# Altium project LowPowerWearable.PrjPcb
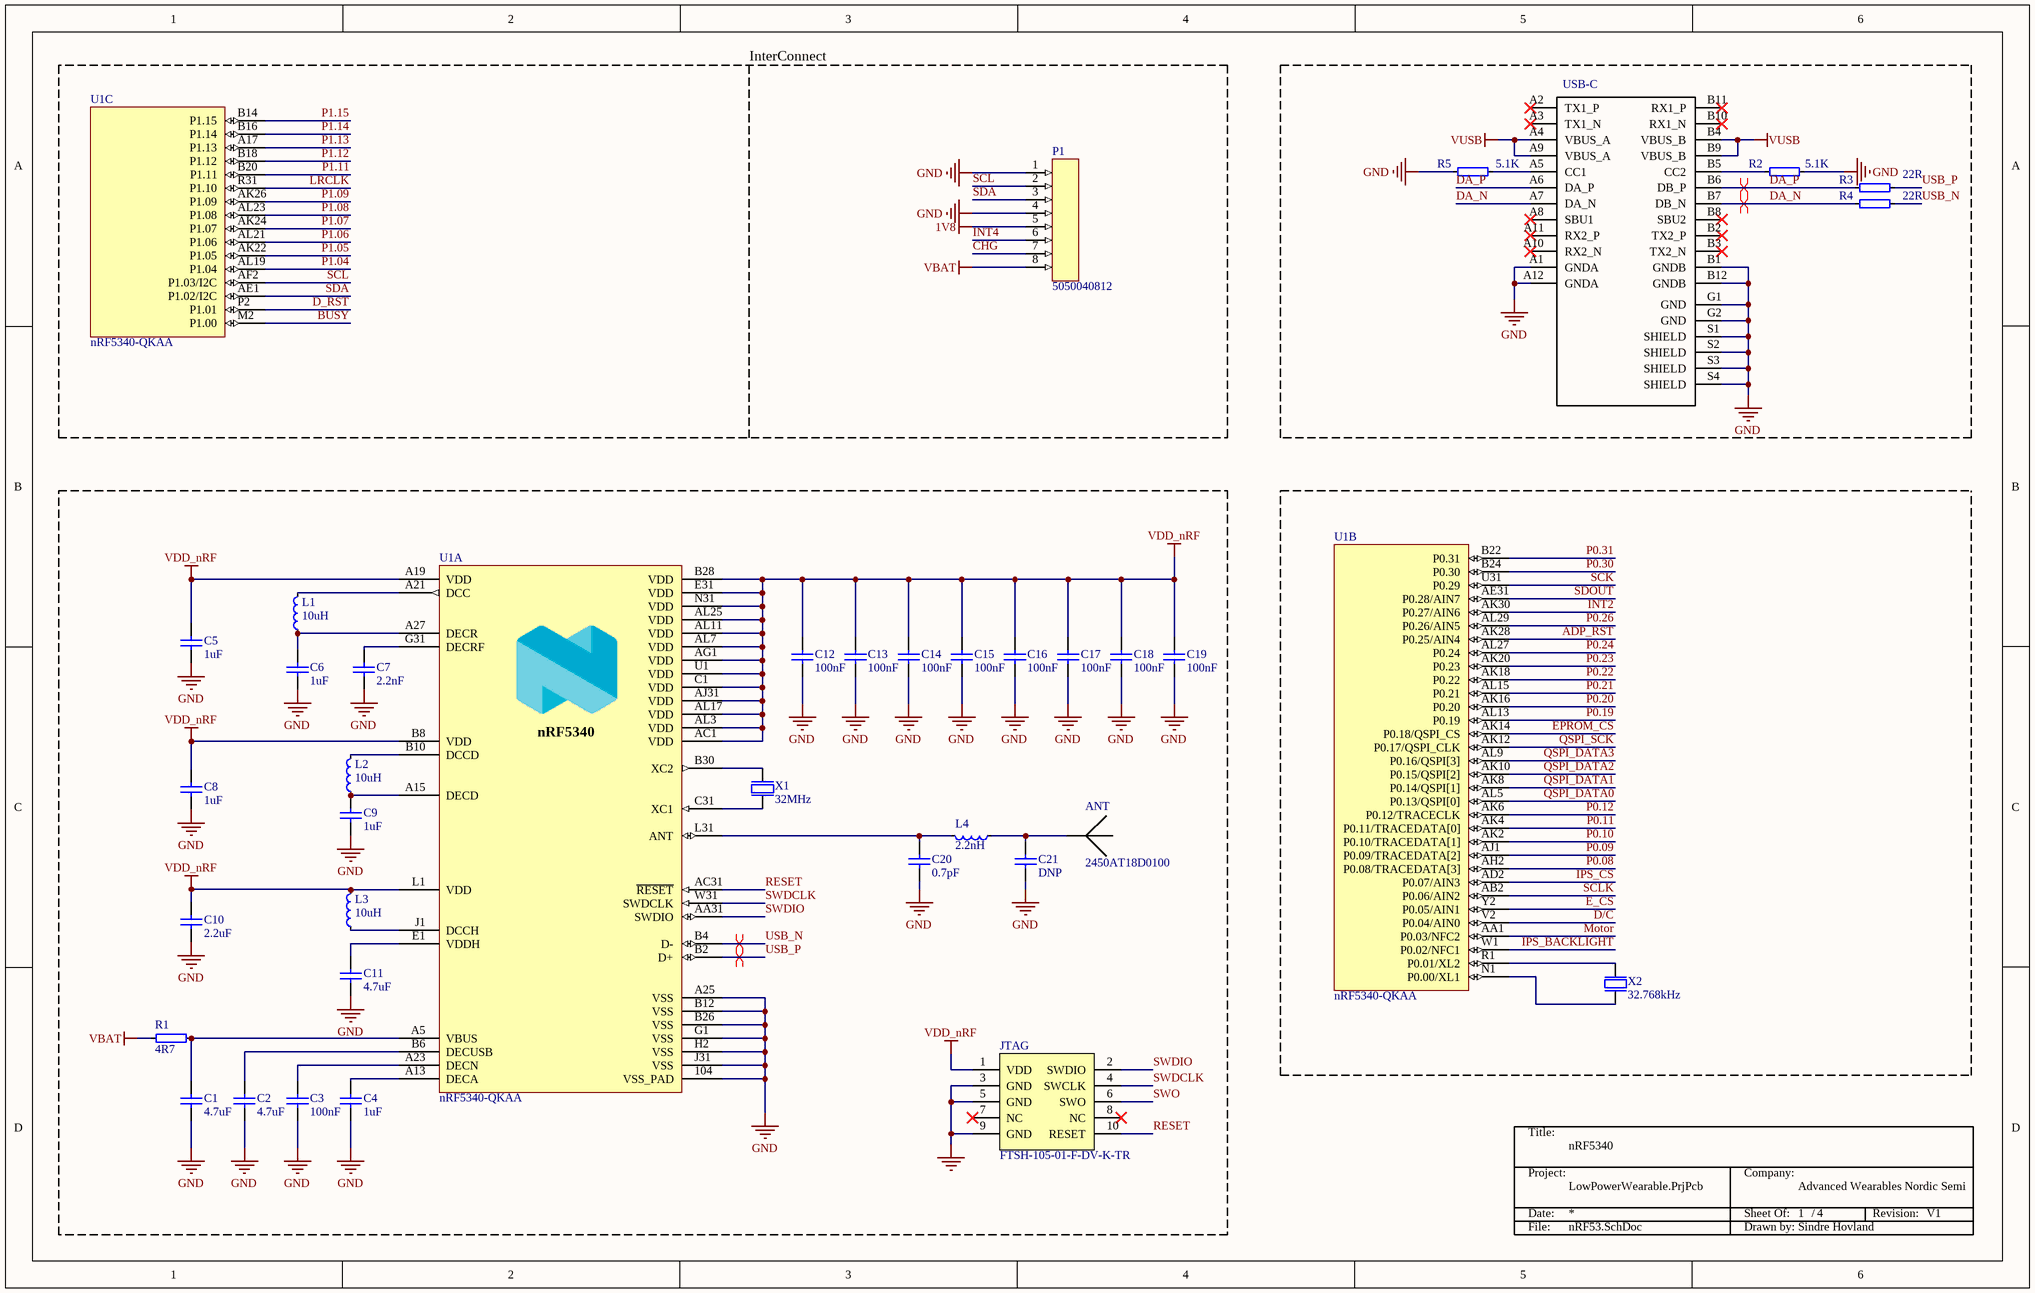
[diagram p0: nRF53.SchDoc]
4 sheets, 104 parts. Net scope: global (net labels, ports and power ports of the same name join across sheets).
Board file: Layout.PcbDoc
Sheets:
  nRF53.SchDoc
  Sensors.SchDoc
  Power.SchDoc
  Display.SchDoc

## Sheet nRF53.SchDoc: nRF5340
size B; DrawnBy: Sindre Hovland; Organization: Advanced Wearables Nordic Semi; Revision: V1; SheetNumber: 1; SheetTotal: 4

### Parts
(Parts that share a designator on the sheet are numbered #1, #2 ... from top to bottom, then left to right.)
*#1  TitleBlock  (value not drawn)  (graphical)
ANT  2450AT18D0100  [2450AT18D0100_STD-L - Thin space]
C1  4.7uF  [C0402]
C2  4.7uF  [C0402]
C3  100nF  [C0402]
C4  1uF  [C0402]
C5  1uF  [C0402]
C6  1uF  [C0402]
C7  2.2nF  [C0402]
C8  1uF  [C0402]
C9  1uF  [C0402]
C10  2.2uF  [C0402]
C11  4.7uF  [C0402]
C12  100nF  [C0402]
C13  100nF  [C0402]
C14  100nF  [C0402]
C15  100nF  [C0402]
C16  100nF  [C0402]
C17  100nF  [C0402]
C18  100nF  [C0402]
C19  100nF  [C0402]
C20  0.7pF  [C0402]
C21  DNP  [C0402]
JTAG  FTSH-105-01-F-DV-K-TR  [TC2050-IDC-NLFP]
L1  10uH  [IND0402]
L2  10uH  [IND0402]
L3  10uH  [IND0402]
L4  2.2nH  [IND0402]
P1  5050040812  [5050040812]
R1  4R7  [RES0402]
R2  5.1K  [RES0402]
R3  22R  [RES0402]
R4  22R  [RES0402]
R5  5.1K  [RES0402]
U1  nRF5340-QKAA  [nRF5340]  (parts A,B,C of 3)
USB-C  2305018-2  [TE_2305018-2_2305018-2(Primary)]  (value not drawn)
X1  32MHz  [XTAL_2016]
X2  32.768kHz  [XTAL_2012]

### Blocks framed on the sheet
InterConnect: P1 U1

### Nets
1V8: P1.5
GND: ANT.2(GND) C1.1 C2.1 C3.1 C4.1 C5.1 C6.1 C7.1 C8.1 C9.1 C10.1 C11.1 C12.1 C13.1 C14.1 C15.1 C16.1 C17.1 C18.1 C19.1 C20.1 C21.1 JTAG.3(GND) JTAG.5(GND) JTAG.9(GND) P1.1 P1.4 R2.2 R5.1 U1.104(VSS_PAD) U1.A25(VSS) U1.B12(VSS) U1.B26(VSS) U1.G1(VSS) U1.H2(VSS) U1.J31(VSS) USB-C.A1(GNDA) USB-C.A12(GNDA) USB-C.B1(GNDB) USB-C.B12(GNDB) USB-C.G1(GND) USB-C.G2(GND) USB-C.S1(SHIELD) USB-C.S2(SHIELD) USB-C.S3(SHIELD) USB-C.S4(SHIELD) X1.2(GND) X1.4(GND)
VBAT: P1.8 R1.2
VDD_nRF: C5.2 C8.2 C10.2 C12.2 C13.2 C14.2 C15.2 C16.2 C17.2 C18.2 C19.2 JTAG.1(VDD) L3.2 U1.A19(VDD) U1.AC1(VDD) U1.AG1(VDD) U1.AJ31(VDD) U1.AL3(VDD) U1.AL7(VDD) U1.AL11(VDD) U1.AL17(VDD) U1.AL25(VDD) U1.B8(VDD) U1.B28(VDD) U1.C1(VDD) U1.E31(VDD) U1.L1(VDD) U1.N31(VDD) U1.U1(VDD)
VUSB: USB-C.A4(VBUS_A) USB-C.A9(VBUS_A) USB-C.B4(VBUS_B) USB-C.B9(VBUS_B)
ADP_RST: U1.AK28(P0.25/AIN4)
BUSY: U1.M2(P1.00)
CHG: P1.7
D/C: U1.V2(P0.04/AIN0)
D_RST: U1.P2(P1.01)
DA_N: R4.1 USB-C.A7(DA_N) USB-C.B7(DB_N)
DA_P: R3.1 USB-C.A6(DA_P) USB-C.B6(DB_P)
E_CS: U1.Y2(P0.05/AIN1)
EPROM_CS: U1.AK14(P0.18/QSPI_CS)
INT2: U1.AK30(P0.27/AIN6)
INT4: P1.6
IPS_BACKLIGHT: U1.W1(P0.02/NFC1)
IPS_CS: U1.AD2(P0.07/AIN3)
LRCLK: U1.R31(P1.10)
Motor: U1.AA1(P0.03/NFC2)
P0.08: U1.AH2(P0.08/TRACEDATA[3])
P0.09: U1.AJ1(P0.09/TRACEDATA[2])
P0.10: U1.AK2(P0.10/TRACEDATA[1])
P0.11: U1.AK4(P0.11/TRACEDATA[0])
P0.12: U1.AK6(P0.12/TRACECLK)
P0.19: U1.AL13(P0.19)
P0.20: U1.AK16(P0.20)
P0.21: U1.AL15(P0.21)
P0.22: U1.AK18(P0.22)
P0.23: U1.AK20(P0.23)
P0.24: U1.AL27(P0.24)
P0.26: U1.AL29(P0.26/AIN5)
P0.30: U1.B24(P0.30)
P0.31: U1.B22(P0.31)
P1.04: U1.AL19(P1.04)
P1.05: U1.AK22(P1.05)
P1.06: U1.AL21(P1.06)
P1.07: U1.AK24(P1.07)
P1.08: U1.AL23(P1.08)
P1.09: U1.AK26(P1.09)
P1.11: U1.B20(P1.11)
P1.12: U1.B18(P1.12)
P1.13: U1.A17(P1.13)
P1.14: U1.B16(P1.14)
P1.15: U1.B14(P1.15)
QSPI_DATA0: U1.AL5(P0.13/QSPI[0])
QSPI_DATA1: U1.AK8(P0.14/QSPI[1])
QSPI_DATA2: U1.AK10(P0.15/QSPI[2])
QSPI_DATA3: U1.AL9(P0.16/QSPI[3])
QSPI_SCK: U1.AK12(P0.17/QSPI_CLK)
RESET: JTAG.10(RESET) U1.AC31(~{RESET})
SCK: U1.U31(P0.29)
SCL: P1.2 U1.AF2(P1.03/I2C)
SCLK: U1.AB2(P0.06/AIN2)
SDA: P1.3 U1.AE1(P1.02/I2C)
SDOUT: U1.AE31(P0.28/AIN7)
SWDCLK: JTAG.4(SWCLK) U1.W31(SWDCLK)
SWDIO: JTAG.2(SWDIO) U1.AA31(SWDIO)
SWO: JTAG.6(SWO)
USB_N: R4.2 U1.B4(D-)
USB_P: R3.2 U1.B2(D+)
NetANT_1: ANT.1 C21.2 L4.1
NetC1_2: C1.2 R1.1 U1.A5(VBUS)
NetC2_2: C2.2 U1.B6(DECUSB)
NetC3_2: C3.2 U1.A23(DECN)
NetC4_2: C4.2 U1.A13(DECA)
NetC6_2: C6.2 L1.1 U1.A27(DECR)
NetC7_2: C7.2 U1.G31(DECRF)
NetC9_2: C9.2 L2.1 U1.A15(DECD)
NetC11_2: C11.2 U1.E1(VDDH)
NetC20_2: C20.2 L4.2 U1.L31(ANT)
NetL1_2: L1.2 U1.A21(DCC)
NetL2_2: L2.2 U1.B10(DCCD)
NetL3_1: L3.1 U1.J1(DCCH)
NetR2_1: R2.1 USB-C.B5(CC2)
NetR5_2: R5.2 USB-C.A5(CC1)
NetU1_B30: U1.B30(XC2) X1.3(out)
NetU1_C31: U1.C31(XC1) X1.1(inp)
NetU1_N1: U1.N1(P0.00/XL1) X2.2(out)
NetU1_R1: U1.R1(P0.01/XL2) X2.1(inp)

Not connected (* = marked no-connect by the designer): JTAG 7(NC)* 8(NC)*; U1 AG31(N.C.) D2(N.C.) F2(N.C.) T2(N.C.); USB-C A2(TX1_P)* A3(TX1_N)* A8(SBU1)* A10(RX2_N)* A11(RX2_P)* B2(TX2_P)* B3(TX2_N)* B8(SBU2)* B10(RX1_N)* B11(RX1_P)*

### Layout directives
differential pair: DA_N, DA_P, USB_N, USB_P

### Notes on the sheet
- (in symbol nRF5340-QKAAAA, part A) nRF5340
- (in symbol TitleBlock) Title:; Project:; Company:; Date:; Sheet Of:; /; Revision:; File:; Drawn by:

### Library data of the parts
ANT = Antenna with GND: 2.45 GHz chip antenna; Part Number: Johanson 2450AT18D0100_STD-L; Manufacturer: Johanson Technology; Part number IPS: N.A.; Artikkelnr Noca: 53059035; Manufacturer Part Number: 2450AT18D0100; ComponentLink1URL: *; ComponentLink1Description: Datasheet; ComponentLink2URL: *; ComponentLink2Description: Supplier link; HelpURL: http://www.johansontechnology.com/datasheets/antennas/2450AT18D0100.pdf; Footprint Doc: 2450AT18D0100; LatestRevisionDate: 2016-06-02; Pin Count: 4; Publisher: Nordic Semiconductor; Published: 2016-01-12; Value: 2450AT18D0100; Note: *; Supplier 1: Digi-Key; Supplier Part Number 1: 2450AT18D0100E; Supplier 2: Mouser; Supplier Part Number 2: 609-2450AT18D0100E
C1-C21 = CAP: Capacitor; Value: 100pF; Published: 8-Jun-2000; Revision: July-2002: Re-released for DXP Platform.; Publisher: Altium Limited
JTAG = JTAG: Pin Header 2x5, 1.27mm (50mil), SMD, Keying Shroud; Part Number: Pin Header 2x5 SMD, 1.27mm, KS; Manufacturer: W-CON; Manufacturer Part Number: 3132-10MS0BK00R1; Part number IPS: N.A.; Artikkelnr Noca: 55010009; Footprint Doc: HDR_2x5-SMD-1.27mm; LatestRevisionDate: 2016-04-21; Pin Count: 10; Publisher: Nordic Semiconductor; Published: 2016-01-22; Value: Pin Header 2x5, 1.27mm; Note: *; ComponentLink1URL: *; ComponentLink1Description: Datasheet; ComponentLink2URL: *; ComponentLink2Description: Supplier link; HelpURL: \\hizz\pro\app9717\Datasheet\connectores\W-CON\3132-XXMXXBK00XX.pdf; Supplier 1: Cabcon; Supplier Part Number 1: 3132-10MS0BK00R1; Supplier 2: Samtec; Supplier Part Number 2: FTSH-105-01-F-DV-K
L1-L4 = IND: Inductor; Part Number: FB0402-120R@100M-500mA; Manufacturer: Murata; Manufacturer Part Number: BLM15AG121SN1D; Part number IPS: N.A.; Value: 120R/0.55A; Note: Chip EMIFIL Inductor Type Chip Ferrite Bead; Artikkelnr Noca: 33029317; Footprint Doc: 0402; LatestRevisionDate: 2014-01-10; Pin Count: 2; Publisher: Nordic Semiconductor; Published: 2011-11-14; ComponentLink1URL: *; ComponentLink1Description: Datasheet; ComponentLink2URL: *; ComponentLink2Description: Supplier link; HelpURL: http://search.murata.co.jp/Ceramy/image/img/PDF/ENG/L0110S0100BLM15A_SN.pdf
P1 = 8 Pin Connector: Generic 8 pin connector, see footprint for MPN
R1-R5 = RES: Resistor, ±5%, 0.05W; Part Number: R0201-0R; Part number IPS: 00000003245; Value: 0R; Note: Chip Res 5%; Artikkelnr Noca: N.A.; Manufacturer: *; Manufacturer Part Number: *; ComponentLink1URL: *; ComponentLink1Description: Datasheet; ComponentLink2URL: *; ComponentLink2Description: Supplier link; HelpURL: *; Footprint Doc: 0201; LatestRevisionDate: 2017-11-09; Pin Count: 2; Publisher: Nordic Semiconductor; Published: 2014-11-13; Supplier 1: *; Supplier Part Number 1: *; Supplier 2: *; Supplier Part Number 2: *
U1 = nRF5340-QKAAAA: Multi-protocol Bluetooth Low Energy, IEEE 802.15.4, ANT and 2.4GHz proprietary system-on-chip; Part Number: nRF5340-QKAADA; Manufacturer: Nordic Semiconductor; Artikkelnr Noca: N.A.; Footprint Doc: AQFN-98; LatestRevisionDate: 2019-03-28; Pin Count: 98; Published: 2017-01-09; Value: nRF5340-QKAA; Manufacturer Part Number: *; ComponentLink1URL: *; ComponentLink1Description: Datasheet; ComponentLink2URL: *; ComponentLink2Description: Supplier link; HelpURL: *; Publisher: Nordic Semiconductor; Note: *; Supplier 1: Nordic Semiconductor; Supplier Part Number 1: nRF5340-QKAADA; Supplier 2: *; Supplier Part Number 2: *; Part number IPS: N.A.
USB-C = IPX8 USBC: TYPE C Right Angle Sealable SMT IPX8 3.1 GEN 2 Wire to Board USB; MF: TE Connectivity; TE_purchase_URL: https://www.te.com/usa-en/product-2305018-2.html?te_bu=Cor&te_type=disp&te_campaign=seda_glo_cor-seda-global-disp-prtnr-fy19-seda-model-bom-cta_sma-317_1&elqCampaignId=32493; SnapEDA_Link: https://www.snapeda.com/parts/2305018-2/TE%20Connectivity%20AMP%20Connectors/view-part/?ref=snap; Availability: Unavailable; Package: None; Price: None; MP: 2305018-2; Value: *
X1 = XTAL_SMD2016: XTAL SMD 2016, 32MHz, Cl=8pF, Total Tol: ±40ppm; Part Number: XTAL_SMD2016_32MHz_8pF_General; LatestRevisionDate: 2016-08-19; Pin Count: 4; Publisher: Nordic Semiconductor; Published: 2016-08-19; Value: 32MHz; Footprint Doc: XTAL_2016; Manufacturer: *; Manufacturer Part Number: *
X2 = XTAL_2-pin: XTAL SMD 32.768kHz, 9pF, ±20ppm; Part Number: XTAL_SMD3215_32.768kHz_9pF_NDK; Manufacturer: NDK; Manufacturer Part Number: NX3215SA-32.768K-STD-MUA-9; Part number IPS: N.A.; Artikkelnr Noca: 22010049; LatestRevisionDate: 2017-10-23; Pin Count: 2; Publisher: Nordic Semiconductor; Published: 2017-10-23; Value: 32.768kHz; Note: XTAL SMD 32.768kHz; Footprint Doc: XTAL_3215; ComponentLink1URL: *; ComponentLink1Description: Datasheet; ComponentLink2URL: *; ComponentLink2Description: Supplier link; HelpURL: *; Supplier 1: Digi-Key; Supplier Part Number 1: 535-11937-6-ND

## Sheet Sensors.SchDoc: Sensor sheet
size A; DrawnBy: Sindre Hovland; Organization: Advanced Wearables Nordic Semi; Revision: V1; SheetNumber: 2; SheetTotal: 4
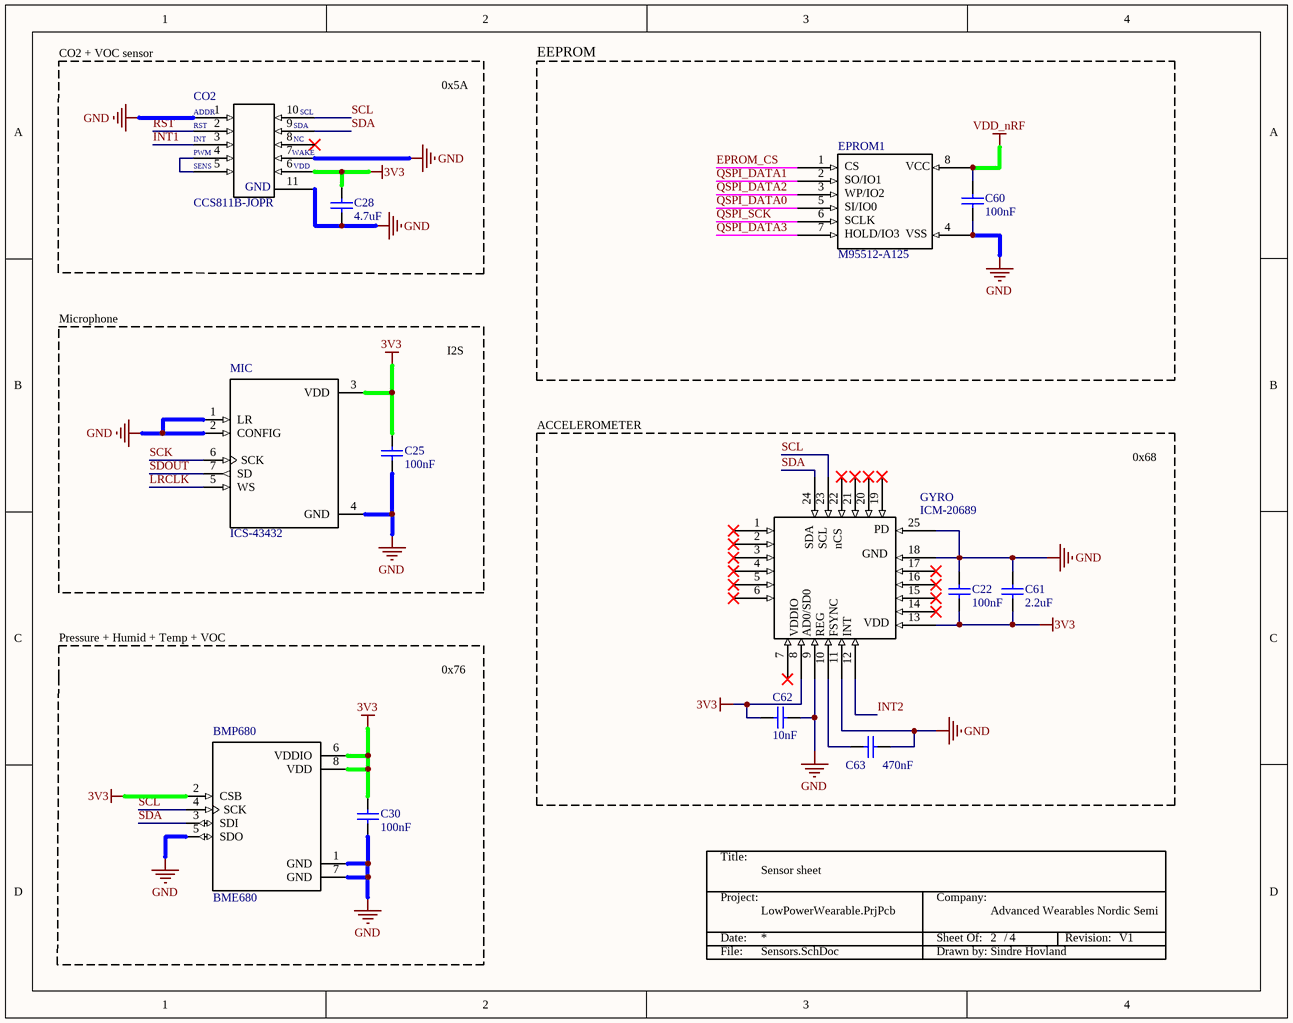
[diagram p1: Sensors.SchDoc]

### Parts
(Parts that share a designator on the sheet are numbered #1, #2 ... from top to bottom, then left to right.)
*#2  TitleBlock  (value not drawn)  (graphical)
BMP680  BME680  [bme680 ic]
C22  100nF  [C0402]
C25  100nF  [C0402]
C28  4.7uF  [C0402]
C30  100nF  [C0402]
C60  100nF  [C0402]
C61  2.2uF  [C0402]
C62  10nF  [C0402]
C63  470nF  [C0402]
CO2  CCS811B-JOPR  [ccs811]
EPROM1  M95512-A125  [M95512-A125]
GYRO  ICM-20689  [QFN50P400X400X90_HS-25N]
MIC  ICS-43432  [MIC_ICS-43432]

### Blocks framed on the sheet
EEPROM: C60 EPROM1

### Nets
3V3: BMP680.2(CSB) BMP680.6(VDDIO) BMP680.8(VDD) C22.1 C25.2 C28.2 C30.1 C61.1 C62.2 CO2.6 GYRO.8 GYRO.13 MIC.3(VDD)
GND: BMP680.1(GND) BMP680.5(SDO) BMP680.7(GND) C22.2 C25.1 C28.1 C30.2 C60.1 C61.2 C62.1 C63.2 CO2.1 CO2.7 CO2.11 EPROM1.4 GYRO.9 GYRO.11 GYRO.18 GYRO.25 MIC.1(LR) MIC.2(CONFIG) MIC.4(GND)
VDD_nRF: C60.2 EPROM1.8
EPROM_CS: EPROM1.1
INT1: CO2.3
INT2: GYRO.12
LRCLK: MIC.5(WS)
QSPI_DATA0: EPROM1.5
QSPI_DATA1: EPROM1.2
QSPI_DATA2: EPROM1.3
QSPI_DATA3: EPROM1.7
QSPI_SCK: EPROM1.6
RST: CO2.2
SCK: MIC.6(SCK)
SCL: BMP680.4(SCK) CO2.10 GYRO.23
SDA: BMP680.3(SDI) CO2.9 GYRO.24
SDOUT: MIC.7(SD)
NetC63_1: C63.1 GYRO.10
NetCO2_4: CO2.4 CO2.5

Not connected (* = marked no-connect by the designer): CO2 8*; GYRO 1* 2* 3* 4* 5* 6* 7* 14* 15* 16* 17* 19* 20* 21* 22*

### Notes on the sheet
- CO2 + VOC sensor
- 0x5A
- Microphone
- I2S
- ACCELEROMETER
- 0x68
- Pressure + Humid + Temp + VOC
- 0x76
- (in symbol CCS811) ADDR; SCL; RST; SDA; INT; NC; PWM; WAKE; SENS; VDD; GND
- (in symbol Flash SPI) CS; VCC; SO/IO1; WP/IO2; SI/IO0; SCLK; HOLD/IO3; VSS
- (in symbol ICM-20689) PD; SDA; SCL; nCS; GND; VDD; VDDIO; AD0/SD0; REG; FSYNC; INT
- (in symbol TitleBlock) Title:; Project:; Company:; Date:; Sheet Of:; /; Revision:; File:; Drawn by:

### Library data of the parts
BMP680 = BME680: / Gas, Humidity, Pressure, Temperature Sensor IÂ²C, SPI Output /; MF: Bosch Sensortec; Digi-Key_Purchase_URL: https://www.digikey.com/product-detail/en/bosch-sensortec/BME680/828-1077-1-ND/7401321?utm_source=snapeda&utm_medium=aggregator&utm_campaign=symbol; SnapEDA_Link: https://www.snapeda.com/parts/BME680/Bosch%20Sensortec/view-part/947201/?ref=snap; MP: BME680; Digi-Key_Part_Number: 828-1077-1-ND; Package: LGA-8 Bosch Tools; Value: *; ComponentLink1Description: Datasheet; ComponentLink1URL: https://www.bosch-sensortec.com/products/environmental-sensors/gas-sensors-bme680/; Supplier 1: Digi-Key; Supplier Part Number 1: 828-1077-1-ND
C22 C25 C28 C30 C60-C63 = CAP: Capacitor; Value: 100pF; Published: 8-Jun-2000; Revision: July-2002: Re-released for DXP Platform.; Publisher: Altium Limited
CO2 = CCS811: CO2 and VOC sensor; ComponentLink1Description: Datasheet; ComponentLink1URL: https://ams.com/ccs811; Manufacturer Part Number: CCS811; Supplier 1: Digi-Key; Supplier Part Number 1: CCS811B-JOPR5KCT-ND
EPROM1 = Flash SPI: EPROM M95512-A125 512K; Supplier 1: Mouser; Supplier Part Number 1: 363-GD25Q16CEIGR
GYRO = ICM-20689: ICM-20689 6 aksis gyro
MIC = ICS-43432: / 50Hz ~ 20kHz Digital, IÂ²S Microphone MEMS _Silicon_ 1.62V ~ 3.63V Omnidirectional _-26dB Â±1dB @ 94dB SPL_ Solder Pads /; MF: TDK InvenSense; SnapEDA_Link: https://www.snapeda.com/parts/ICS-43432/TDK%20InvenSense/view-part/63105/?ref=snap; Price: None; MP: ICS-43432; Package: LGA-7 TDK-InvenSense; Availability: Unavailable; Value: *; Supplier 1: Digi-Key; Supplier Part Number 1: 1428-1053-1-ND

## Sheet Power.SchDoc: Power
size A; DrawnBy: Sindre Hovland; Organization: Advanced Wearables Nordic Semi; Revision: V1; SheetNumber: 3; SheetTotal: 4
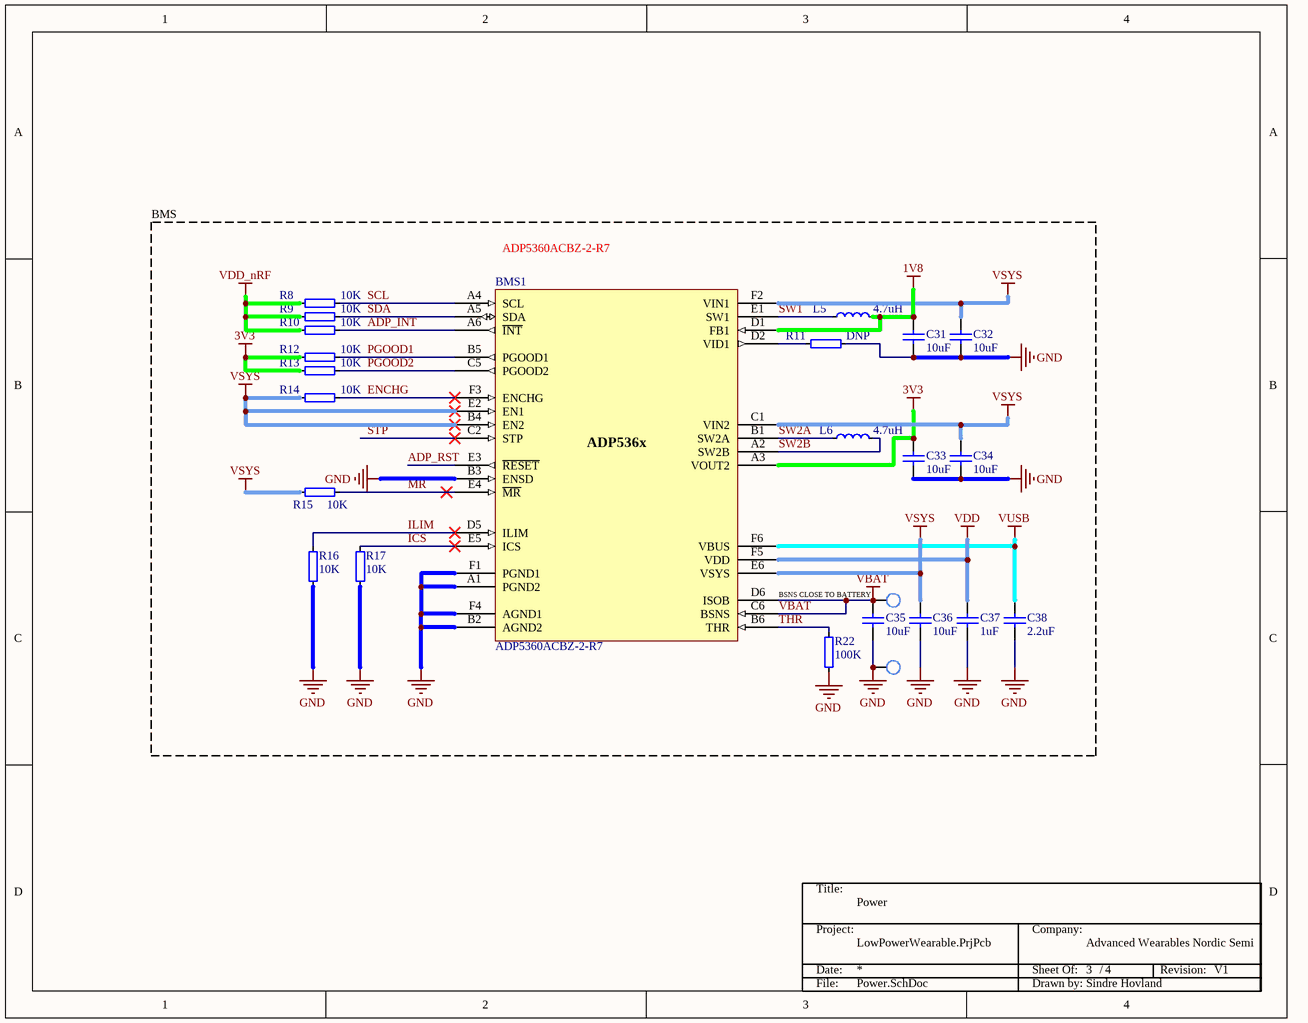
[diagram p2: Power.SchDoc]

### Parts
(Parts that share a designator on the sheet are numbered #1, #2 ... from top to bottom, then left to right.)
*#3  TitleBlock  (value not drawn)  (graphical)
BMS1  ADP5360ACBZ-2-R7  [BGA32C40P6X6_238X238X56]
C31  10uF  [C0603]
C32  10uF  [C0603]
C33  10uF  [C0603]
C34  10uF  [C0603]
C35  10uF  [C0603]
C36  10uF  [C0603]
C37  1uF  [C0402]
C38  2.2uF  [C0402]
GND  DNP  [TP_SMD_1.0mm]  (value not drawn)
L5  4.7uH  [IND2016]
L6  4.7uH  [IND2016]
R8  10K  [RES0402]
R9  10K  [RES0402]
R10  10K  [RES0402]
R11  DNP  [RES0402]
R12  10K  [RES0402]
R13  10K  [RES0402]
R14  10K  [RES0402]
R15  10K  [RES0402]
R16  10K  [RES0402]
R17  10K  [RES0402]
R22  100K  [RES0402]
VBAT  DNP  [TP_SMD_1.0mm]  (value not drawn)

### Nets
1V8: BMS1.D1(FB1) C31.2 L5.2
3V3: BMS1.A3(VOUT2) C33.2 R12.1 R13.1
GND: BMS1.A1(PGND2) BMS1.B2(AGND2) BMS1.B3(ENSD) BMS1.F1(PGND1) BMS1.F4(AGND1) C31.1 C32.1 C33.1 C34.1 C35.1 C36.1 C37.1 C38.1 GND.1 R11.2 R16.2 R17.2 R22.2
VBAT: BMS1.C6(BSNS) BMS1.D6(ISOB) C35.2 VBAT.1
VDD: BMS1.F5(VDD) C37.2
VDD_nRF: R8.1 R9.1 R10.1
VSYS: BMS1.B4(EN2) BMS1.C1(VIN2) BMS1.E2(EN1) BMS1.E6(VSYS) BMS1.F2(VIN1) C32.2 C34.2 C36.2 R14.1 R15.1
VUSB: BMS1.F6(VBUS) C38.2
ADP_INT: BMS1.A6(~{INT}) R10.2
ADP_RST: BMS1.E3(~{RESET})
ENCHG: BMS1.F3(ENCHG) R14.2
ICS: BMS1.E5(ICS) R17.1
ILIM: BMS1.D5(ILIM) R16.1
~{MR}: BMS1.E4(~{MR}) R15.2
PGOOD1: BMS1.B5(PGOOD1) R12.2
PGOOD2: BMS1.C5(PGOOD2) R13.2
SCL: BMS1.A4(SCL) R8.2
SDA: BMS1.A5(SDA) R9.2
STP: BMS1.C2(STP)
SW1: BMS1.E1(SW1) L5.1
SW2A: BMS1.B1(SW2A) L6.1
SW2B: BMS1.A2(SW2B) L6.2
THR: BMS1.B6(THR) R22.1
NetBMS1_D2: BMS1.D2(VID1) R11.1

### Notes on the sheet
- BMS
- (near BMS1) ADP5360ACBZ-2-R7
- BSNS CLOSE TO BATTERY
- (in symbol TitleBlock) Title:; Project:; Company:; Date:; Sheet Of:; /; Revision:; File:; Drawn by:

### Library data of the parts
BMS1 = ADP536x: Advanced Battery Management PMIC With Ultralow Iq Buck and Buck-Boost. Order: ADP5360ACBZ-2-R7; Manufacturer: Analog Devices; Part number IPS: 80000001823; Artikkelnr Noca: N.A.; Part Number: ADP536x; Manufacturer Part Number: ADP536x; ComponentLink1URL: *; ComponentLink1Description: Datasheet; ComponentLink2URL: *; ComponentLink2Description: Supplier link; HelpURL: *; Footprint Doc: WLCSP-32; LatestRevisionDate: 2019-03-25; Pin Count: 32; Publisher: Nordic Semiconductor; Published: 2019-03-25; Value: ADP536x; Note: *; Supplier 1: *; Supplier Part Number 1: *; Supplier 2: *; Supplier Part Number 2: *
C31-C38 = CAP: Capacitor; Value: 100pF; Published: 8-Jun-2000; Revision: July-2002: Re-released for DXP Platform.; Publisher: Altium Limited
GND VBAT = TP
L5 L6 = IND: as L1 on sheet nRF53; Footprint Doc: 0402; LatestRevisionDate: 2014-01-10; Pin Count: 2; Publisher: Nordic Semiconductor; Published: 2011-11-14; ComponentLink1URL: *; ComponentLink1Description: Datasheet; ComponentLink2URL: *; ComponentLink2Description: Supplier link; HelpURL: http://search.murata.co.jp/Ceramy/image/img/PDF/ENG/L0110S0100BLM15A_SN.pdf
R8-R17 R22 = RES: as R1 on sheet nRF53; Manufacturer: *; Manufacturer Part Number: *; ComponentLink1URL: *; ComponentLink1Description: Datasheet; ComponentLink2URL: *; ComponentLink2Description: Supplier link; HelpURL: *; Footprint Doc: 0201; LatestRevisionDate: 2017-11-09; Pin Count: 2; Publisher: Nordic Semiconductor; Published: 2014-11-13; Supplier 1: *; Supplier Part Number 1: *; Supplier 2: *; Supplier Part Number 2: *

## Sheet Display.SchDoc: Display
size A4; DrawnBy: Sindre Hovland; Organization: Advanced Wearables Nordic Semi; Revision: V1; SheetNumber: 4; SheetTotal: 4
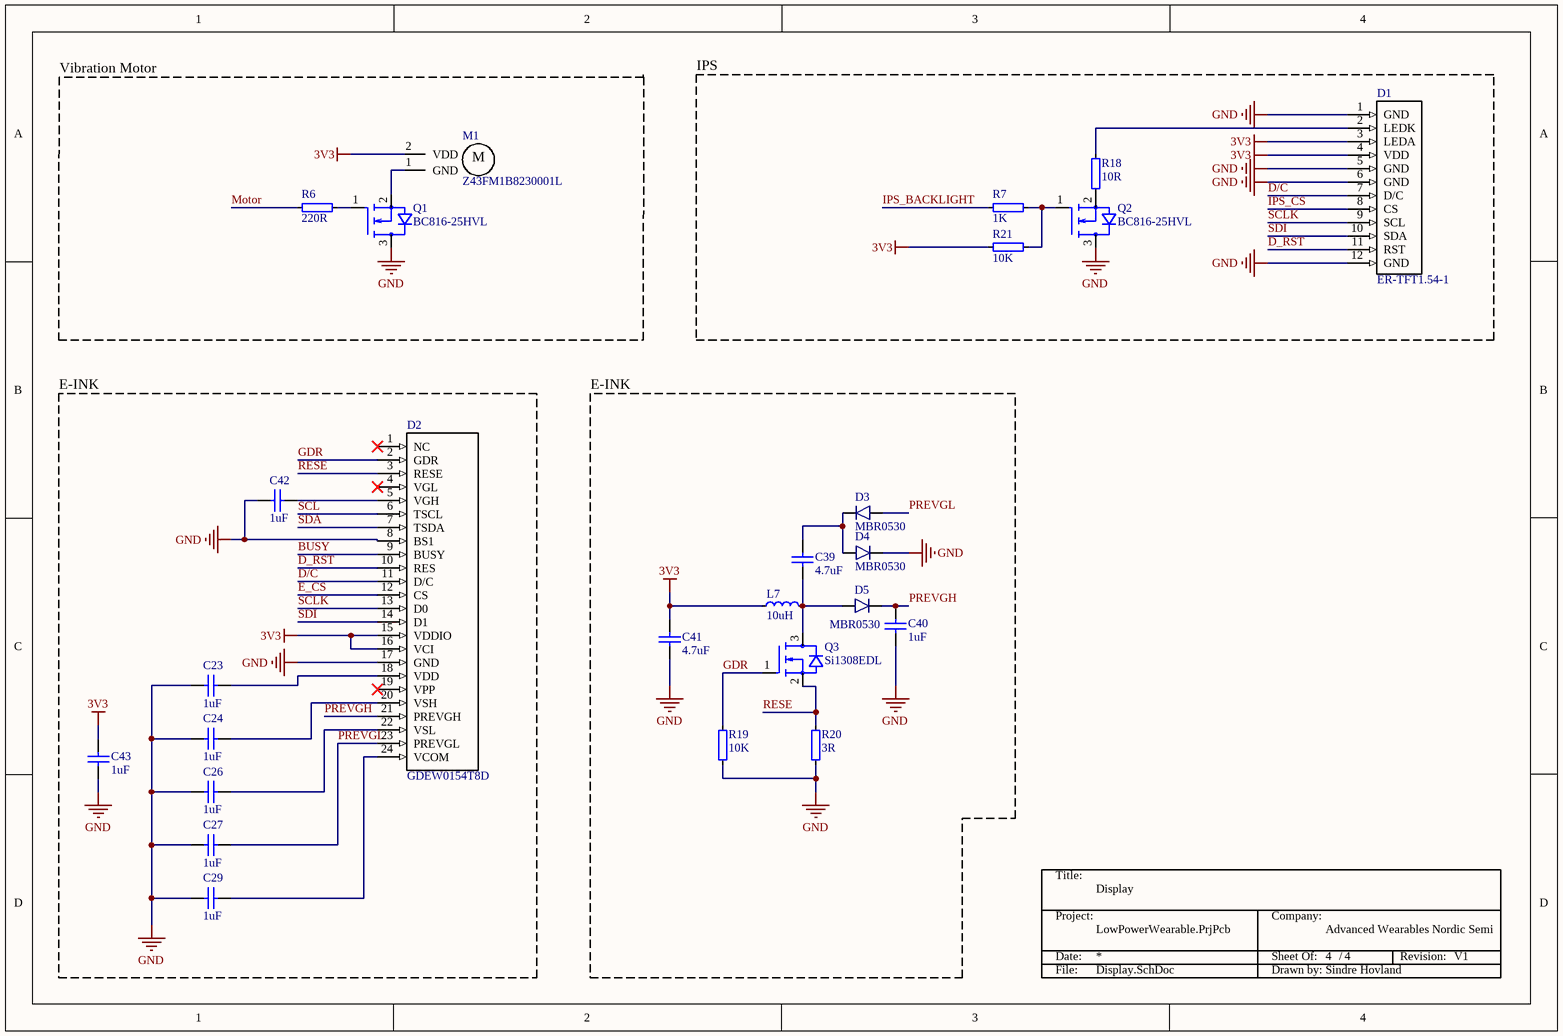
[diagram p3: Display.SchDoc]

### Parts
(Parts that share a designator on the sheet are numbered #1, #2 ... from top to bottom, then left to right.)
*#4  TitleBlock  (value not drawn)  (graphical)
C23  1uF  [C0402]
C24  1uF  [C0402]
C26  1uF  [C0402]
C27  1uF  [C0402]
C29  1uF  [C0402]
C39  4.7uF  [C0402]
C40  1uF  [C0402]
C41  4.7uF  [C0402]
C42  1uF  [C0402]
C43  1uF  [C0402]
D1  ER-TFT1.54-1  [IPS 1.54 inches]
D2  GDEW0154T8D  [E-Papaer 1.54inches]
D3  MBR0530  [SOD-123]
D4  MBR0530  [SOD-123]
D5  MBR0530  [SOD-123]
L7  10uH  [IND0402]
M1  Z43FM1B8230001L  [Z43FM1B8230001L]
Q1  BC816-25HVL  [SOT23-3]
Q2  BC816-25HVL  [SOT23-3]
Q3  Si1308EDL  [SOT323]
R6  220R  [RES0603R]
R7  1K  [RES0402]
R18  10R  [RES0402]
R19  10K  [RES0402]
R20  3R  [RES0402]
R21  10K  [RES0402]

### Blocks framed on the sheet
Vibration Motor: M1 Q1 R6
IPS: D1 Q2 R7 R18 R21
E-INK: C23 C24 C26 C27 C29 C42 C43 D2
E-INK: C39-C41 D3-D5 L7 Q3 R19 R20

### Nets
3V3: C41.1 C43.1 D1.3(LEDA) D1.4(VDD) D2.15(VDDIO) D2.16(VCI) L7.1 M1.2(VDD) R21.1
GND: C23.2 C24.2 C26.2 C27.2 C29.2 C40.2 C41.2 C42.1 C43.2 D1.1(GND) D1.5(GND) D1.6(GND) D1.12(GND) D2.8(BS1) D2.17(GND) D4.2(C) Q1.3(D) Q2.3(D) R19.1 R20.1
BUSY: D2.9(BUSY)
D/C: D1.7(D/C) D2.11(D/C)
D_RST: D1.11(RST) D2.10(RES)
E_CS: D2.12(CS)
GDR: D2.2(GDR) Q3.1(G) R19.2
IPS_BACKLIGHT: R7.1
IPS_CS: D1.8(CS)
Motor: R6.1
PREVGH: C40.1 D2.21(PREVGH) D5.2(C)
PREVGL: C27.1 D2.23(PREVGL) D3.1(A)
RESE: D2.3(RESE) Q3.2(S) R20.2
SCL: D2.6(TSCL)
SCLK: D1.9(SCL) D2.13(D0)
SDA: D2.7(TSDA)
SDI: D1.10(SDA) D2.14(D1)
NetC23_1: C23.1 D2.18(VDD)
NetC24_1: C24.1 D2.20(VSH)
NetC26_1: C26.1 D2.22(VSL)
NetC29_1: C29.1 D2.24(VCOM)
NetC39_1: C39.1 D3.2(C) D4.1(A)
NetC39_2: C39.2 D5.1(A) L7.2 Q3.3(D)
NetC42_2: C42.2 D2.5(VGH)
NetD1_2: D1.2(LEDK) R18.2
NetM1_1: M1.1(GND) Q1.2(S)
NetQ1_1: Q1.1(G) R6.2
NetQ2_1: Q2.1(G) R7.2 R21.2
NetQ2_2: Q2.2(S) R18.1

Not connected (* = marked no-connect by the designer): D2 1(NC)* 4(VGL)* 19(VPP)*

### Notes on the sheet
- (in symbol TitleBlock) Title:; Project:; Company:; Date:; Sheet Of:; /; Revision:; File:; Drawn by:
- (in symbol Vibration Motor) M

### Library data of the parts
C23 C24 C26 C27 C29 C39-C43 = CAP: Capacitor; Value: 100pF; Published: 8-Jun-2000; Revision: July-2002: Re-released for DXP Platform.; Publisher: Altium Limited
D1 = IPS 1.54 inch: IPS display 1.54 inch SPI
D2 = E-Paper 1.54 inch: E-Paper 1.54 inch with integrated driver
D3-D5 = Diode: Switch-mode Schottky / Power Rectifier / 250 V, 40 A
L7 = IND: as L1 on sheet nRF53; Footprint Doc: 0402; LatestRevisionDate: 2014-01-10; Pin Count: 2; Publisher: Nordic Semiconductor; Published: 2011-11-14; ComponentLink1URL: *; ComponentLink1Description: Datasheet; ComponentLink2URL: *; ComponentLink2Description: Supplier link; HelpURL: http://search.murata.co.jp/Ceramy/image/img/PDF/ENG/L0110S0100BLM15A_SN.pdf
M1 = Vibration Motor: SMD Vibration Motor / https://www.vibration-motor.com/cylindrical-vibrator-motors/smt-surface-mount-reflow/z43fm1b8230001l; ComponentLink1Description: Manufacturer; ComponentLink1URL: https://www.vibration-motor.com/cylindrical-vibrator-motors/smt-surface-mount-reflow/z43fm1b8230001l
Q1-Q3 = Transistor: N-Channel 20V 100mA _Ta_ 150mW _Ta_ Surface Mount VMT3; MF: Rohm; MP: RUM001L02T2CL; Value: *; SnapEDA_Link: https://www.snapeda.com/parts/RUM001L02T2CL/Rohm/view-part/531428/?ref=snap; Digi-Key_Part_Number: RUM001L02T2CLCT-ND; Digi-Key_Purchase_URL: https://www.digikey.com/product-detail/en/rohm-semiconductor/RUM001L02T2CL/RUM001L02T2CLCT-ND/4571412?utm_source=snapeda&utm_medium=aggregator&utm_campaign=symbol; Package: SOT-723 Rohm
R6 R7 R18-R21 = RES: as R1 on sheet nRF53; Manufacturer: *; Manufacturer Part Number: *; ComponentLink1URL: *; ComponentLink1Description: Datasheet; ComponentLink2URL: *; ComponentLink2Description: Supplier link; HelpURL: *; Footprint Doc: 0201; LatestRevisionDate: 2017-11-09; Pin Count: 2; Publisher: Nordic Semiconductor; Published: 2014-11-13; Supplier 1: *; Supplier Part Number 1: *; Supplier 2: *; Supplier Part Number 2: *

## Nets that join several sheets
1V8: nRF53 (P1.5), Power (BMS1.D1 C31.2 L5.2)
3V3: Sensors (13 pins), Power (BMS1.A3 C33.2 R12.1 R13.1), Display (9 pins)
GND: nRF53 (48 pins), Sensors (22 pins), Power (18 pins), Display (20 pins)
VBAT: nRF53 (P1.8 R1.2), Power (BMS1.C6 BMS1.D6 C35.2 VBAT.1)
VDD_nRF: nRF53 (29 pins), Sensors (C60.2 EPROM1.8), Power (R8.1 R9.1 R10.1)
VUSB: nRF53 (USB-C.A4 USB-C.A9 USB-C.B4 USB-C.B9), Power (BMS1.F6 C38.2)
ADP_RST: nRF53 (U1.AK28), Power (BMS1.E3)
BUSY: nRF53 (U1.M2), Display (D2.9)
D/C: nRF53 (U1.V2), Display (D1.7 D2.11)
D_RST: nRF53 (U1.P2), Display (D1.11 D2.10)
E_CS: nRF53 (U1.Y2), Display (D2.12)
EPROM_CS: nRF53 (U1.AK14), Sensors (EPROM1.1)
INT2: nRF53 (U1.AK30), Sensors (GYRO.12)
IPS_BACKLIGHT: nRF53 (U1.W1), Display (R7.1)
IPS_CS: nRF53 (U1.AD2), Display (D1.8)
LRCLK: nRF53 (U1.R31), Sensors (MIC.5)
Motor: nRF53 (U1.AA1), Display (R6.1)
QSPI_DATA0: nRF53 (U1.AL5), Sensors (EPROM1.5)
QSPI_DATA1: nRF53 (U1.AK8), Sensors (EPROM1.2)
QSPI_DATA2: nRF53 (U1.AK10), Sensors (EPROM1.3)
QSPI_DATA3: nRF53 (U1.AL9), Sensors (EPROM1.7)
QSPI_SCK: nRF53 (U1.AK12), Sensors (EPROM1.6)
SCK: nRF53 (U1.U31), Sensors (MIC.6)
SCL: nRF53 (P1.2 U1.AF2), Sensors (BMP680.4 CO2.10 GYRO.23), Power (BMS1.A4 R8.2), Display (D2.6)
SCLK: nRF53 (U1.AB2), Display (D1.9 D2.13)
SDA: nRF53 (P1.3 U1.AE1), Sensors (BMP680.3 CO2.9 GYRO.24), Power (BMS1.A5 R9.2), Display (D2.7)
SDOUT: nRF53 (U1.AE31), Sensors (MIC.7)

## Assembly variants
Default: not fitted VBAT